# Altium schematic sheet Scheme.SchDoc
size 209 x 297 mm; Address1: Address1; Address2: Address2; Address3: Address3; Address4: Address4; DocumentNumber: АБВГ.123456.001 Э3; SheetNumber: 1; Scale: 1:1; DocumentType: Схема электрическая принципиальная; FirstReferrence: АБВГ.123456.001; PageSetup: Record=PageOptions|CenterHorizontal=True|CenterVertical=True|PrintScale=1.00|XCorrection=1.00|YCorrection=1.00|PrintKind=1|BorderSize=5000000|LeftOffset=0|BottomOffset=0|Orientation=2|PaperLength=1000|PaperWidth=1000|Scale=100|PaperSource=15|PrintQuality=1200|MediaType=1|DitherType=10|PaperKind=A3|PrintScaleMode=1; Weight: -; ScaleFactor: -
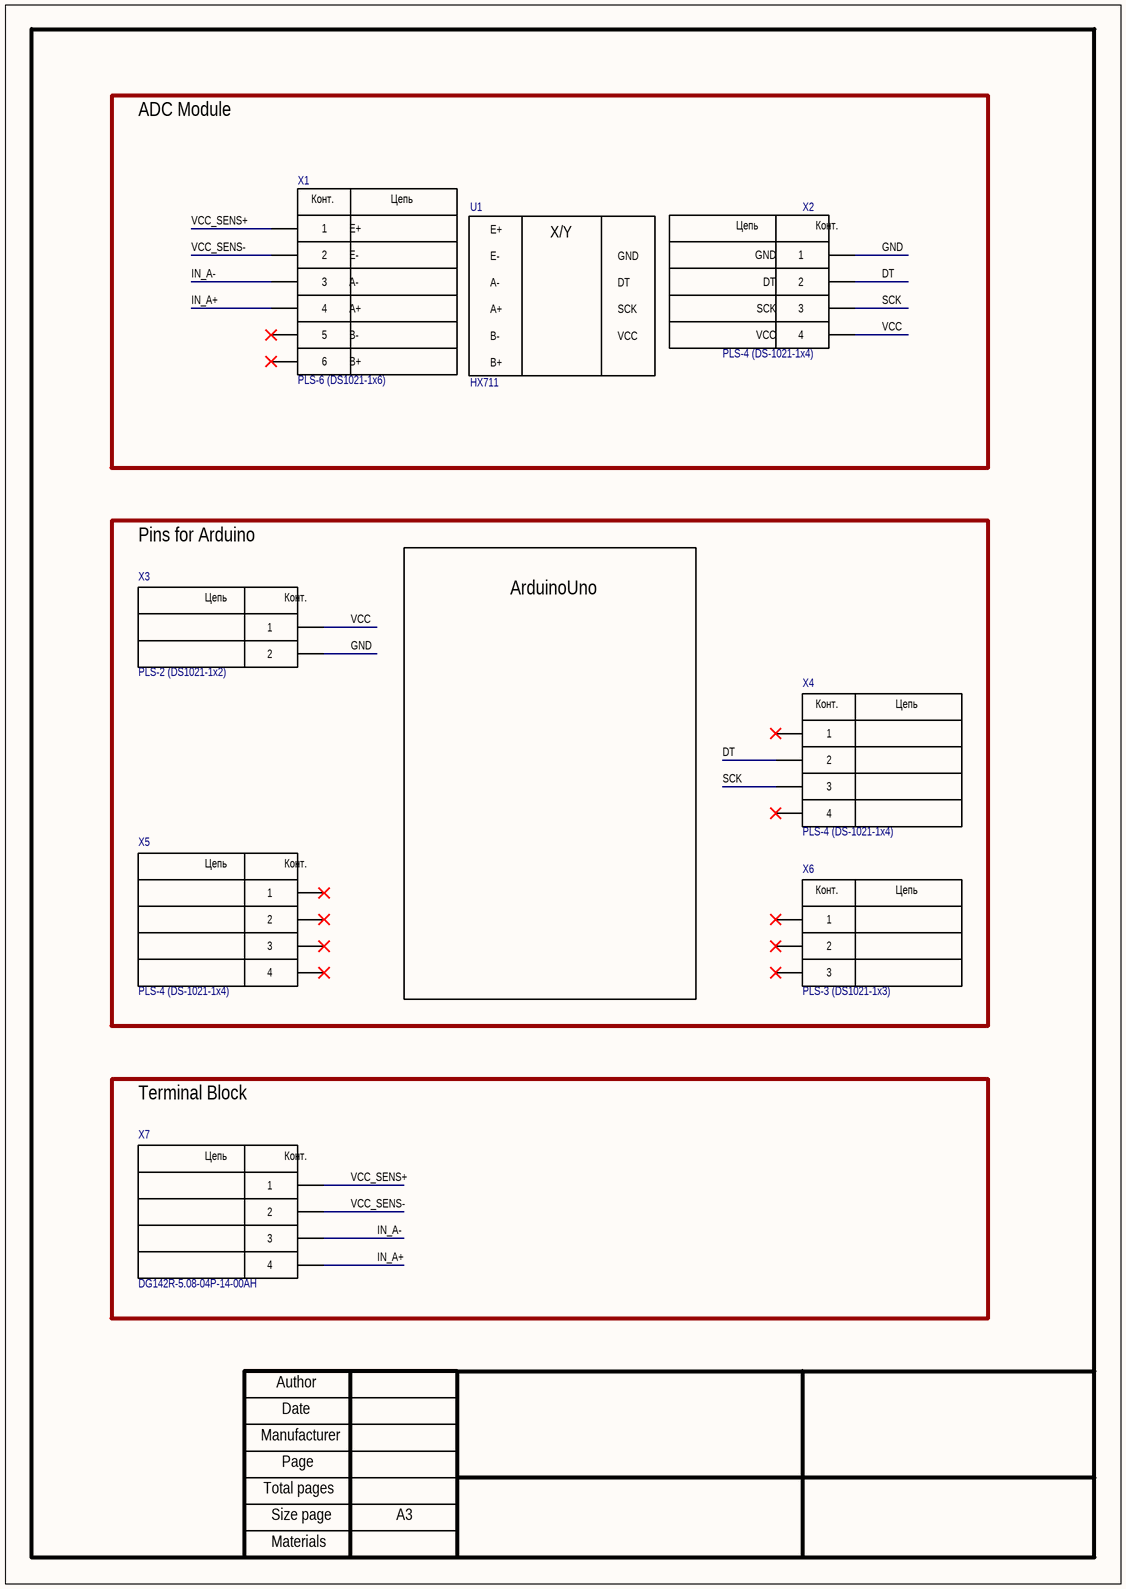
[diagram p0: Scheme.SchDoc]

## Parts
U1  HX711  [HX711]
X1  PLS-6 (DS1021-1x6)  [CON: PLS-6]
X2  PLS-4 (DS-1021-1x4)  [CON: PLS-4]
X3  PLS-2 (DS1021-1x2)  [CON: PLS-2]
X4  PLS-4 (DS-1021-1x4)  [CON: PLS-4]
X5  PLS-4 (DS-1021-1x4)  [CON: PLS-4]
X6  PLS-3 (DS1021-1x3)  [CON: PLS-3]
X7  DG142R-5.08-04P-14-00AH  [CON: DG142V-5.08-4P]

## Blocks framed on the sheet
ADC Module: U1 X1 X2
Terminal Block: X7

## Nets
DT: X2.2(DT________2) X4.2
GND: X2.1(GND________1) X3.2
IN_A+: X1.4(4________A+) X7.4
IN_A-: X1.3(3________A-) X7.3
SCK: X2.3(SCK________3) X4.3
VCC: X2.4(VCC________4) X3.1
VCC_SENS+: X1.1(1________E+) X7.1
VCC_SENS-: X1.2(2________E-) X7.2

Not connected (* = marked no-connect by the designer): X1 5(5________B-)* 6(6________B+)*; X4 1* 4*; X5 1* 2* 3* 4*; X6 1* 2* 3*

## Notes on the sheet
- Pins for Arduino
- ArduinoUno
- Author
- Manufacturer
- Date
- Page
- Total pages
- Size page
- A3
- Materials
- (in symbol 2-Connector) Цепь; Конт.
- (in symbol 3-Connector) Конт.; Цепь
- (in symbol 4-Connector) Цепь; Конт.
- (in symbol 6-Connector) Конт.; Цепь
- (in symbol HX711) E+; X/Y; E-; GND; A-; DT; A+; SCK; B-; VCC; B+

## Library data of the parts
U1 = HX711: ADC Module; Manufacturer: OKYSTAR; Manufacturer Part Number: 8002691862; ComponentKind: TH; ComponentLink1Description: HeplURL; ComponentLink1URL: https://www.chipdip.ru/product0/8002691862; HeplURL: https://www.chipdip.ru/product0/8002691862
X1 = 6-Connector: Manufacturer: Connfly electronic (Zhenqin); Model: PLS-6 (DS1021-1x6); HelpURL: https://www.chipdip.ru/product/pls-6; ComponentKind: TH
X2 X4 X5 = 4-Connector: Manufacturer: Connfly electronic (Zhenqin); Model: PLS-4 (DS-1021-1x4); HelpURL: https://www.chipdip.ru/product/pls-4; ComponentKind: TH
X3 = 2-Connector: Manufacturer: Connfly electronic (Zhenqin); Model: PLS-2 (DS1021-1x2); HelpURL: https://www.chipdip.ru/product/pls-2; ComponentKind: TH
X6 = 3-Connector: Manufacturer: Connfly electronic (Zhenqin); Model: PLS-3 (DS1021-1x3); HelpURL: https://www.chipdip.ru/product/pls-3; ComponentKind: TH
X7 = 4-Connector: Manufacturer: Degson Electronics; Model: DG142R-5.08-04P-14-00AH; HelpURL: https://www.chipdip.ru/product0/8001774654; ComponentKind: TH